# Altium project CANSAT-Measurement-PWR-4v.PrjPcb
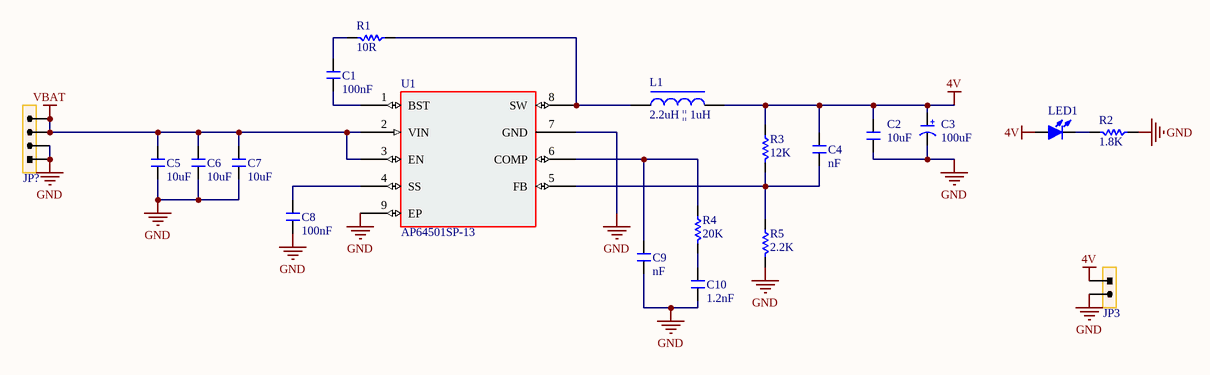
[diagram p0: Main.SchDoc]
1 sheet, 20 parts. Net scope: global (net labels, ports and power ports of the same name join across sheets).
Board file: CANSAT-Measurement-PWR-4v PCB.PcbDoc

## Sheet Main.SchDoc
size A4; SheetNumber: 1; SheetTotal: 1

### Parts
C1  100nF  [C 0603]
C2  10uF  [C 0805]
C3  100uF  [CD D(7343)]
C4  nF  [C 0603]
C5  10uF  [C 0805]
C6  10uF  [C 0805]
C7  10uF  [C 0805]
C8  100nF  [C 0603]
C9  nF  [C 0603]
C10  1.2nF  [C 0603]
JP3  HDR-1X2  [XH2.54-2P_H]  (value not drawn)
JP?  HDR-1X4  [HDR-1X4]  (value not drawn)
L1  2.2uH || 1uH  [CD53]
LED1  LED-SMD  [LED 0603R]  (value not drawn)
R1  10R  [R 0603]
R2  1.8K  [R 0603]
R3  12K  [R 0603]
R4  20K  [R 0603]
R5  2.2K  [R 0603]
U1  AP64501SP-13  [SOP8_M-EP]

### Nets
4V: C2.1 C3.1(A) C4.1 JP3.1 L1.2 LED1.1(A) R3.1
GND: C2.2 C3.2(K) C5.2 C6.2 C7.2 C8.2 C9.2 C10.2 JP3.2 JP?.1 JP?.2 R2.1 R5.2 U1.7(GND) U1.9(EP)
VBAT: C5.1 C6.1 C7.1 JP?.3 JP?.4 U1.2(VIN) U1.3(EN)
NetC1_1: C1.1 R1.2
NetC1_2: C1.2 U1.1(BST)
NetC4_2: C4.2 R3.2 R5.1 U1.5(FB)
NetC8_1: C8.1 U1.4(SS)
NetC9_1: C9.1 R4.1 U1.6(COMP)
NetC10_1: C10.1 R4.2
NetL1_1: L1.1 R1.1 U1.8(SW)
NetLED1_2: LED1.2(K) R2.2

### Notes on the sheet
- (in symbol C-CD) +

### Library data of the parts
C1 C2 C4-C10 = C: Non-polar patch capacitor; BOM名称: 无极性贴片电容; 版权归属: 源创客; 学习资源: www.ooocke.com
C3 = C-CD: Solid Tantalum Chip Capacitor, Standard T491 Series - Industrial Grade; Published: 17-Jul-2002; LatestRevisionDate: 19-Mar-2004; LatestRevisionNote: Silkscreen dimensions re-sized.; DatasheetDocument: Mar-2001; PackageDocument: Mar-2001; PackageReference: B; Publisher: Altium Limited; Code_JEITA: 3528-21; ComponentLink1Description: Manufacturer Link; ComponentLink1URL: http://www.kemet.com/; ComponentLink2Description: Datasheet; ComponentLink2URL: http://www.kemet.com/kemet/web/homepage/kechome.nsf/vapubfilesname/F3102TA.pdf/$file/F3102TA.pdf
JP3 = Header 2: 2P Connector; BOM名称: 2P接插件; 版权归属: 源创客; 学习资源: www.ooocke.com
JP? = Header 4: 4P Connector; BOM名称: 4P接插件; 版权归属: 源创客; 学习资源: www.ooocke.com
L1 = L-CD: Chip power inductor; BOM名称: 功率电感; 版权归属: 源创客; 学习资源: www.ooocke.com
LED1 = LED-SMD: Patch LED; BOM名称: 贴片LED; 版权归属: 源创客; 学习资源: www.ooocke.com
R1-R5 = R: Chip resistor; 版权归属: 源创客; BOM名称: Chip resistor; 学习资源: www.ooocke.com